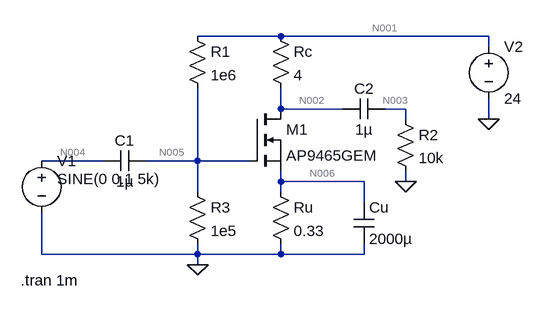
[diagram p0: schematic Усилитель.asc]
Усилитель.asc, the LTspice schematic file:
Version 4
SHEET 1 880 680
WIRE 160 0 32 0
WIRE 480 0 160 0
WIRE 480 16 480 0
WIRE 160 112 160 80
WIRE 256 112 160 112
WIRE 352 112 320 112
WIRE 352 128 352 112
WIRE 480 128 480 96
WIRE -112 192 -208 192
WIRE 32 192 32 80
WIRE 32 192 -48 192
WIRE 112 192 32 192
WIRE 160 224 160 208
WIRE 288 224 160 224
WIRE 352 224 352 208
WIRE 32 240 32 192
WIRE 160 240 160 224
WIRE 288 256 288 224
WIRE -208 336 -208 272
WIRE 32 336 32 320
WIRE 32 336 -208 336
WIRE 160 336 160 320
WIRE 160 336 32 336
WIRE 288 336 288 320
WIRE 288 336 160 336
WIRE 32 352 32 336
FLAG 480 128 0
FLAG 32 352 0
FLAG 352 224 0
SYMBOL nmos 112 112 R0
SYMATTR InstName M1
SYMATTR Value AP9465GEM
SYMBOL res 144 -16 R0
SYMATTR InstName Rс
SYMATTR Value 4
SYMBOL res 144 224 R0
SYMATTR InstName Ru
SYMATTR Value 0.33
SYMBOL res 16 224 R0
SYMATTR InstName R3
SYMATTR Value 1e5
SYMBOL res 16 -16 R0
SYMATTR InstName R1
SYMATTR Value 1e6
SYMBOL cap -48 176 R90
WINDOW 0 0 32 VBottom 2
WINDOW 3 32 32 VTop 2
SYMATTR InstName C1
SYMATTR Value 1µ
SYMBOL cap 320 96 R90
WINDOW 0 0 32 VBottom 2
WINDOW 3 32 32 VTop 2
SYMATTR InstName C2
SYMATTR Value 1µ
SYMBOL voltage -208 176 R0
WINDOW 123 24 124 Left 2
WINDOW 39 0 0 Left 0
WINDOW 3 24 44 Left 2
SYMATTR InstName V1
SYMATTR Value SINE(0 0.1 5k)
SYMBOL voltage 480 0 R0
WINDOW 123 0 0 Left 0
WINDOW 39 0 0 Left 0
SYMATTR InstName V2
SYMATTR Value 24
SYMBOL cap 272 256 R0
SYMATTR InstName Cu
SYMATTR Value 2000µ
SYMBOL res 336 112 R0
SYMATTR InstName R2
SYMATTR Value 10k
TEXT -240 376 Left 2 !.tran 1m

The netlist it stands for:
* Усилитель.asc
M1 N002 N005 N006 N006 AP9465GEM
Rс N001 N002 4
Ru N006 0 0.33
R3 N005 0 1e5
R1 N001 N005 1e6
C1 N005 N004 1µ
C2 N003 N002 1µ
V1 N004 0 SINE(0 0.1 5k)
V2 N001 0 24
Cu N006 0 2000µ
R2 N003 0 10k
.model NMOS NMOS
.model PMOS PMOS
.lib standard.mos
.tran 1m
.backanno
.end

* Results of the author's LTspice run, read from the files saved beside the schematic
* Operating Point, zero values left out:
*   V(n002) = 21.18 V
*   V(n005) = 2.182 V
*   V(n006) = 233 mV
*   V(n001) = 24 V
*   Id(M1) = 706 mA
*   Is(M1) = -706 mA
*   I(R1) = 21.82 µA
*   I(R3) = 21.82 µA
*   I(Ru) = 706 mA
*   I(Rс) = 706 mA
*   I(V2) = -706.1 mA
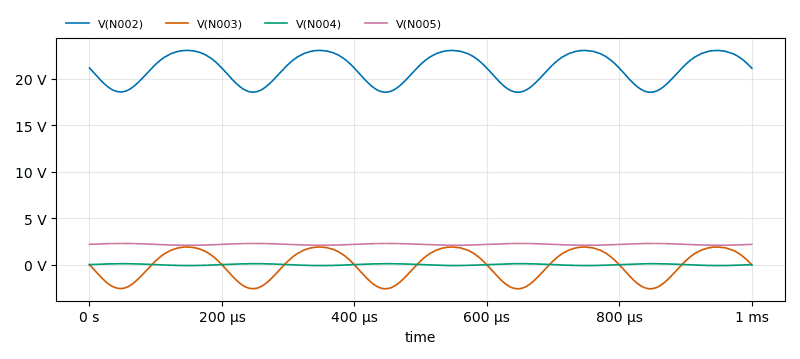
[diagram p1: Transient Analysis of Усилитель.asc, plotted from the saved traces]
* Transient Analysis, 1 run:
*   V(N002): min 18.56 V, max 23.07 V, average 21.09 V, rms 21.15 V, last 21.15 V
*   V(N003): min -2.602 V, max 1.903 V, average -79.05 mV, rms 1.605 V, last -22.94 mV
*   V(N004): min -99.9 mV, max 99.99 mV, average 184.2 µV, rms 70.57 mV, last 0 V
*   V(N005): min 2.082 V, max 2.282 V, average 2.182 V, rms 2.183 V, last 2.182 V